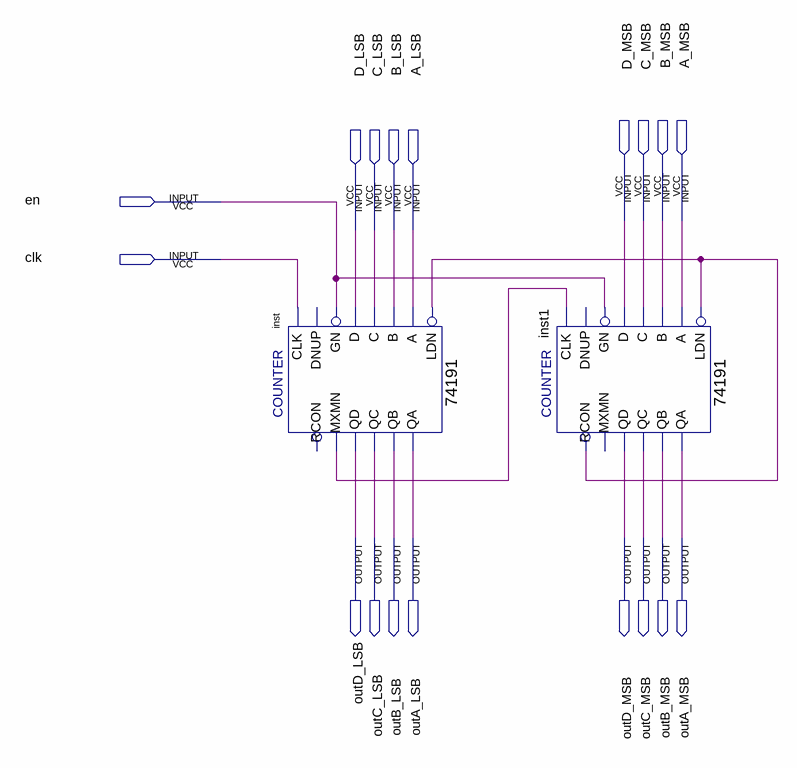
[diagram p0: schematic sheet]
// Quartus schematic part3_2_block.bdf as structural Verilog: 2 symbols, 18 pins
module part3_2_block (
  input  en,
  input  D_MSB,
  input  C_MSB,
  input  B_MSB,
  input  A_MSB,
  input  D_LSB,
  input  C_LSB,
  input  B_LSB,
  input  A_LSB,
  input  clk,
  output outD_LSB,
  output outC_LSB,
  output outB_LSB,
  output outA_LSB,
  output outD_MSB,
  output outC_MSB,
  output outB_MSB,
  output outA_MSB
);

  wire inst1_rcon, inst_mxmn;

  \74191  inst (
    .LDN(inst1_rcon), .D(D_LSB), .C(C_LSB), .B(B_LSB), .A(A_LSB), .CLK(clk), .GN(en), .MXMN(inst_mxmn),
    .QA(outA_LSB), .QB(outB_LSB), .QD(outD_LSB), .QC(outC_LSB));  // open: DNUP, RCON
  \74191  inst1 (
    .LDN(inst1_rcon), .D(D_MSB), .C(C_MSB), .B(B_MSB), .A(A_MSB), .CLK(inst_mxmn), .GN(en),
    .RCON(inst1_rcon), .QA(outA_MSB), .QB(outB_MSB), .QD(outD_MSB), .QC(outC_MSB));  // open: DNUP, MXMN
endmodule
